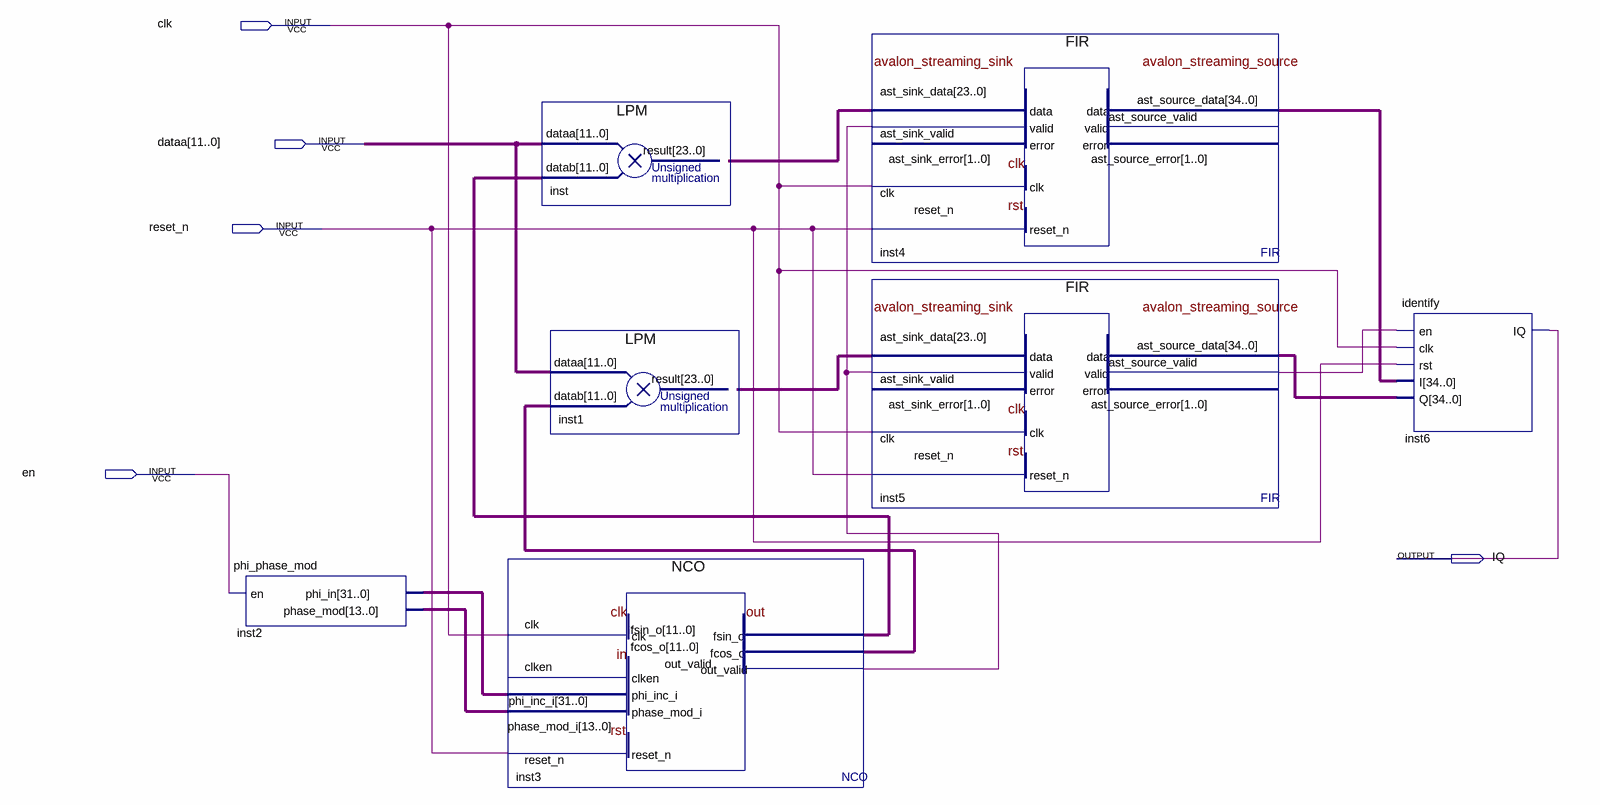
[diagram p0: schematic sheet]
// Quartus schematic QPSKDecode.bdf as structural Verilog: 7 symbols, 5 pins
module QPSKDecode (
  input  clk,
  input  [11:0] dataa,
  input  reset_n,
  input  en,
  output IQ
);

  wire inst3_out_valid, inst5_ast_source_valid;
  wire [11:0] inst3_fcos_o, inst3_fsin_o;
  wire [13:0] inst2_phase_mod;
  wire [23:0] inst1_result, inst_result;
  wire [31:0] inst2_phi_in;
  wire [34:0] inst4_ast_source_data, inst5_ast_source_data;

  phi_phase_mod inst2 (.en(en), .phi_in(inst2_phi_in), .phase_mod(inst2_phase_mod));
  LPM inst (.dataa(dataa), .datab(inst3_fsin_o), .result(inst_result));
  LPM inst1 (.dataa(dataa), .datab(inst3_fcos_o), .result(inst1_result));
  NCO inst3 (
    .clk(clk), .phi_inc_i(inst2_phi_in), .phase_mod_i(inst2_phase_mod), .reset_n(reset_n),
    .fsin_o(inst3_fsin_o), .fcos_o(inst3_fcos_o), .out_valid(inst3_out_valid));  // open: clken
  FIR inst4 (
    .ast_sink_data(inst_result), .ast_sink_valid(inst3_out_valid), .clk(clk), .reset_n(reset_n),
    .ast_source_data(inst4_ast_source_data));  // open: ast_sink_error, ast_source_valid, ast_source_error
  FIR inst5 (
    .ast_sink_data(inst1_result), .ast_sink_valid(inst3_out_valid), .clk(clk), .reset_n(reset_n),
    .ast_source_data(inst5_ast_source_data), .ast_source_valid(inst5_ast_source_valid));  // open: ast_sink_error, ast_source_error
  identify inst6 (
    .en(inst5_ast_source_valid), .clk(clk), .rst(reset_n), .I(inst4_ast_source_data),
    .Q(inst5_ast_source_data), .IQ(IQ));
endmodule
